# Altium project ECG_Project.PrjPCB
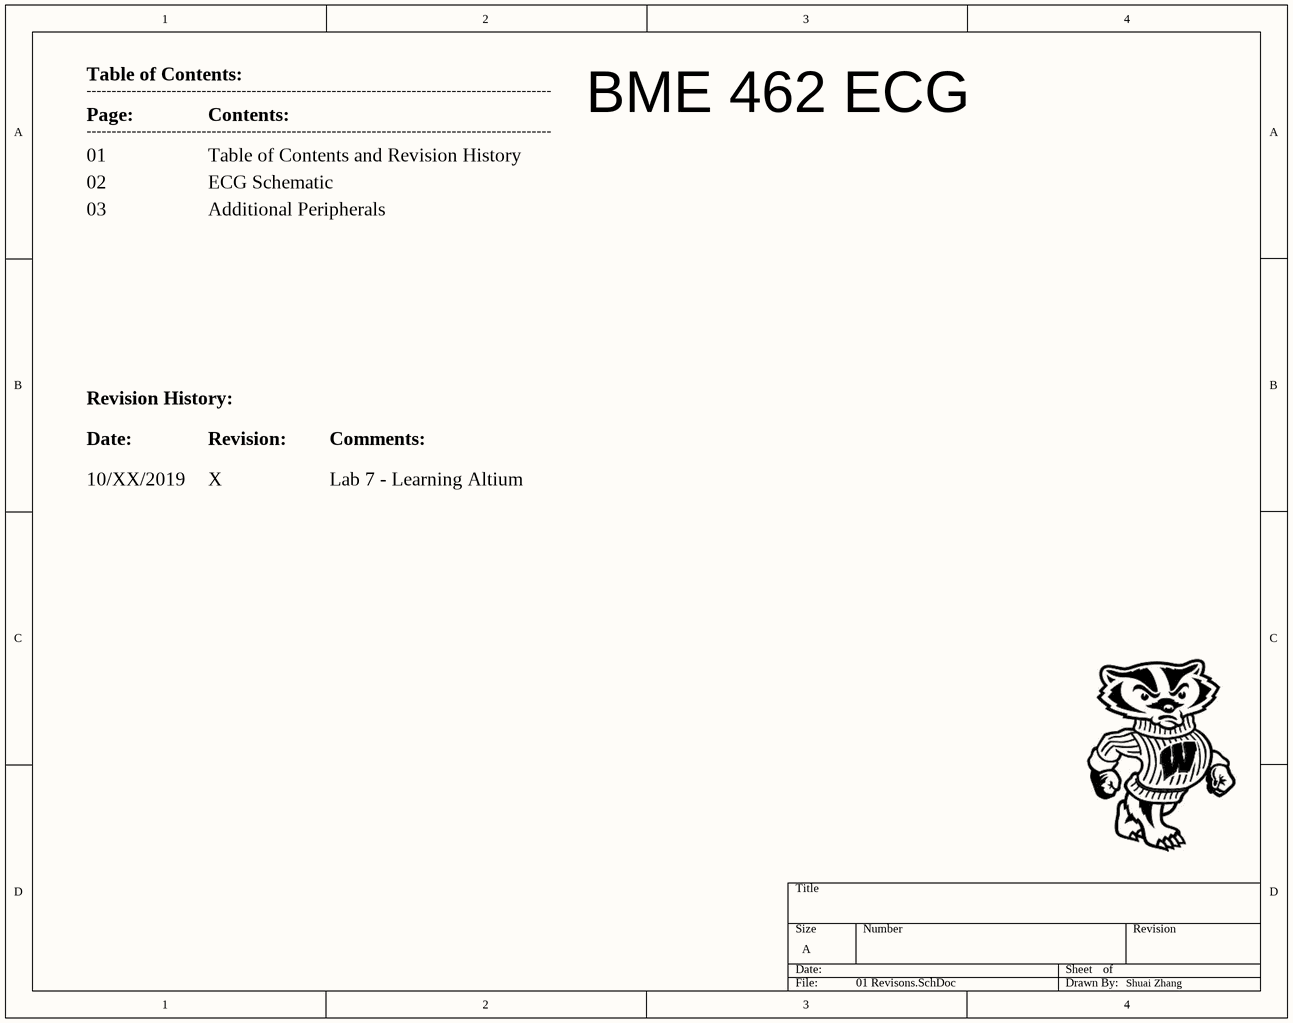
[diagram p0: 01 Revisons.SchDoc]
2 sheets, 26 parts. Net scope: global (net labels, ports and power ports of the same name join across sheets).
Board file: myPCB.PcbDoc
Sheets:
  01 Revisons.SchDoc
  02 ECG Amplifier.schdoc

## Sheet 01 Revisons.SchDoc
size A

### Notes on the sheet
- Table of Contents:
- ---------------------------------------------------------------------------------------------
- Page:
- 01
- Contents:
- Table of Contents and Revision History
- BME 462 ECG
- 02
- 03
- ECG Schematic
- Additional Peripherals
- Revision History:
- Date:
- 10/XX/2019
- Revision:
- X
- Comments:
- Lab 7 - Learning Altium
- Shuai Zhang

## Sheet 02 ECG Amplifier.schdoc
size A
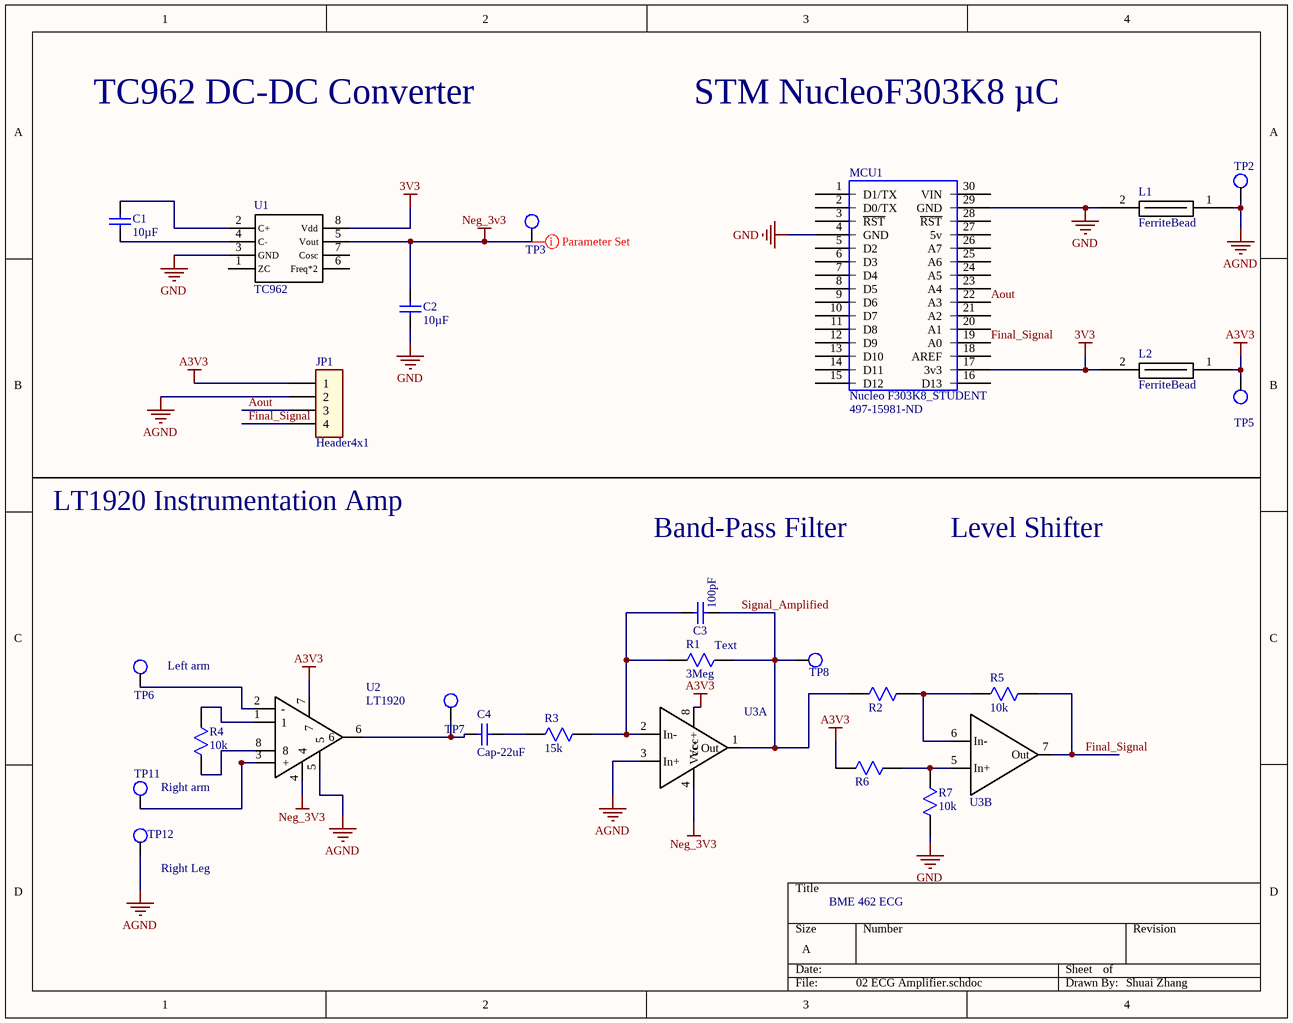
[diagram p1: 02 ECG Amplifier.schdoc]

### Parts
C1  Capacitance: 10µF  [Capacitor]  (hidden comment: Cap-10u)
C2  Capacitance: 10µF  [Capacitor]  (hidden comment: Cap-10u)
C3  Cap-100pF  [Capacitor]  (value not drawn)
C4  Cap-22uF  [Capacitor - Polarized]
JP1  Header4x1  [4 pin header]
L1  FerriteBead  [RESISTOR]
L2  FerriteBead  [RESISTOR]
MCU1  Nucleo F303K8_STUDENT  Supplier Part Number 1: 497-15981-ND  [Nucleo F303K8]
R1  Resistance (Ohms): 3Meg  [RESISTOR]  (hidden comment: Res-3M)
R2  20k  [RESISTOR]  (value not drawn)
R3  15k  [RESISTOR]
R4  Resistance (Ohms): 10k  [RESISTOR]  (hidden comment: Res-10k)
R5  Resistance (Ohms): 10k  [RESISTOR]  (hidden comment: Res-10k)
R6  20k  [RESISTOR]  (value not drawn)
R7  Resistance (Ohms): 10k  [RESISTOR]  (hidden comment: Res-10k)
TP2  TestPoint  [TestPoint]  (value not drawn)
TP3  TestPoint  [TestPoint]  (value not drawn)
TP5  TestPoint  [TestPoint]  (value not drawn)
TP6  TestPoint  [TestPoint]  (value not drawn)
TP7  TestPoint  [TestPoint]  (value not drawn)
TP8  TestPoint  [TestPoint]  (value not drawn)
TP11  TestPoint  [TestPoint]  (value not drawn)
TP12  TestPoint  [TestPoint]  (value not drawn)
U1  TC962  [DIP8]
U2  LT1920  [DIP8]
U3  TL072  [DIP8]  (value not drawn)  (parts A,B of 2)

### Nets
3V3: L2.2 MCU1.17(3v3) U1.8(Vdd)
A3V3: JP1.1 L2.1 R6.1 TP5.1 U2.7 U3.8(Vcc+)
AGND: JP1.2 L1.1 TP2.1 TP12.1 U2.5 U3.3(In+)
GND: C2.1 L1.2 MCU1.4(GND) MCU1.29(GND) R7.2 U1.3(GND)
Neg_3v3: C2.2 TP3.1 U1.5(Vout) U2.4 U3.4(Vcc-)
Aout: JP1.3 MCU1.22(A3)
Final_Signal: JP1.4 MCU1.19(A0) R5.2 U3.7(Out)
Signal_Amplified: C3.1 R1.2 R2.1 TP8.1 U3.1(Out)
NetC1_1: C1.1 U1.4(C-)
NetC1_2: C1.2 U1.2(C+)
NetC3_2: C3.2 R1.1 R3.2 U3.2(In-)
NetC4_1: C4.1 TP7.1 U2.6
NetC4_2: C4.2 R3.1
NetR2_2: R2.2 R5.1 U3.6(In-)
NetR4_1: R4.1 U2.1
NetR4_2: R4.2 U2.8
NetR6_2: R6.2 R7.1 U3.5(In+)
NetTP6_1: TP6.1 U2.2(-)
NetTP11_1: TP11.1 U2.3(+)

Not connected (* = marked no-connect by the designer): MCU1 1(D1/TX) 2(D0/TX) 3(~{RST}) 5(D2) 6(D3) 7(D4) 8(D5) 9(D6) 10(D7) 11(D8) 12(D9) 13(D10) 14(D11) 15(D12) 16(D13) 18(AREF) 20(A1) 21(A2) 23(A4) 24(A5) 25(A6) 26(A7) 27(5v) 28(~{RST}) 30(VIN); U1 1(ZC) 6(Freq*2) 7(Cosc)

### Notes on the sheet
- TC962 DC-DC Converter
- STM NucleoF303K8 µC
- LT1920 Instrumentation Amp
- Band-Pass Filter
- Level Shifter
- (near TP6) Left arm
- (near R1) Text
- Right arm
- (near TP12) Right Leg
- BME 462 ECG
- Shuai Zhang
- (in symbol Cap-100pF) 100pF

### Library data of the parts
C1 C2 = Cap-10u: Manufacturer: TDK Corporation; Manufacturer Part Number: FK26X7R1C106K; Tolerance: ±10%; Voltage - Rated: 16V; Temperature Coefficient: X7R; Supplier 1: Digi-Key; RoHS: RoHS Compliant; Category: Capacitors; Stock 1: 7933; Pricing 1: 1=0.45, 10=0.319, 100=0.2101, 250=0.17896, 500=0.1556, 1000=0.13226, 5000=0.1167, 10000=0.10892, 25000=0.10503 (USD); Packaging: Bulk; Mounting Type: Through Hole; Operating Temperature: -55°C ~ 125°C; Applications: General Purpose; Ratings: -; Package / Case: Radial; Size / Dimension: 0.217" L x 0.138" W (5.50mm x 3.50mm); Height - Seated (Max): 0.236" (6.00mm); Thickness (Max): -; Lead Spacing: 0.197" (5.00mm); Features: -; Lead Style: Formed Leads - Kinked; ComponentLink1URL: https://product.tdk.com/info/en/documents/catalog/leadmlcc_conventional_fk_en.pdf; ComponentLink1Description: https://product.tdk.com/info/en/documents/catalog/leadmlcc_conventional_fk_en.pdf; Supplier Part Number 1: 445-8549-ND
L1 L2 = FerriteBead: Manufacturer: Laird-Signal Integrity Products; Manufacturer Part Number: 28L0138-10R-10; Number of Lines: 1; Impedance @ Frequency: 75 Ohm @ 100MHz; Current Rating (Max): 5A; DC Resistance (DCR) (Max): 10 mOhm; Supplier 1: Digi-Key; RoHS: RoHS Compliant; Category: Filters; Stock 1: 25546; Pricing 1: 1=0.1, 10=0.076, 25=0.0684, 50=0.05, 100=0.0433, 250=0.03416, 500=0.02884, 1000=0.02429 (USD); Packaging: Cut Tape (CT); Part Status: Active; Filter Type: -; Ratings: -; Operating Temperature: -; Package / Case: Axial; Mounting Type: Through Hole; Height (Max): -; Size / Dimension: 0.138" Dia x 0.175" L (3.51mm x 4.45mm); ComponentLink1URL: http://media.digikey.com/pdf/Data%20Sheets/Laird%20Technologies/28L0138-10R-10_Dwg.pdf; ComponentLink1Description: http://media.digikey.com/pdf/Data%20Sheets/Laird%20Technologies/28L0138-10R-10_Dwg.pdf; Supplier Part Number 1: 240-2438-1-ND
MCU1 = Nucleo F303K8_STUDENT: Nucleo F303K8; Manufacturer: Sullins Connector Solutions; Manufacturer Part Number: PPTC151LFBN-RC; Connector Type: Header; Style: Board to Board; Number of Positions: 15; Number of Positions Loaded: All; Pitch - Mating: 0.100" (2.54mm); Contact Length - Post: 0.126" (3.20mm); Material Flammability Rating: UL94 V-0; Current Rating: 3A; Voltage Rating: 250V; Evaluation Kit: Yes; Number of Bits: 32; Core Architecture: ARM; RoHS: RoHS Compliant; Category: Connectors, Interconnects; Packaging: Bulk; Part Status: Active; Contact Type: Female Socket; Number of Rows: 1; Row Spacing - Mating: -; Mounting Type: Through Hole; Termination: Solder; Fastening Type: Push-Pull; Contact Finish - Mating: Tin; Contact Finish Thickness - Mating: -; Insulation Color: Black; Insulation Height: 0.335" (8.51mm); Operating Temperature: -40°C ~ 105°C; Contact Finish - Post: Tin; Mated Stacking Heights: -; Ingress Protection: -; Features: -; Applications: -; Insulation Material: Polyester; Contact Shape: Square; Contact Material: Phosphor Bronze; Contact Finish Thickness - Post: -; ComponentLink1URL: http://www.sullinscorp.com/drawings/78_P(N)PxCxxxLFBN-RC,_10492-H.pdf; ComponentLink1Description: http://www.sullinscorp.com/drawings/78_P(N)PxCxxxLFBN-RC,_10492-H.pdf; REACH SVHC: No SVHC; Lead Free: Lead Free; Supplier 1: Digi-Key; Stock 1: 117; Pricing 1: 1=10.99000 (USD); ComponentLink2URL: http://www.farnell.com/datasheets/2064195.pdf?src-supplier=Farnell; ComponentLink2Description: http://www.farnell.com/datasheets/2064195.pdf?src-supplier=Farnell; ComponentLink3URL: http://www.st.com/content/ccc/resource/technical/document/data_brief/b1/d8/13/d4/b0/b7/4b/6e/DM00214578.pdf/files/DM00214578.pdf/jcr:content/translations/en.DM00214578.pdf?src-supplier=Digi-Key; ComponentLink3Description: http://www.st.com/content/ccc/resource/technical/document/data_brief/b1/d8/13/d4/b0/b7/4b/6e/DM00214578.pdf/files/DM00214578.pdf/jcr:content/translations/en.DM00214578.pdf?src-supplier=Digi-Key; ComponentLink4URL: http://www.farnell.com/datasheets/1966773.pdf?src-supplier=Element14; ComponentLink4Description: http://www.farnell.com/datasheets/1966773.pdf?src-supplier=Element14; ComponentLink5URL: http://www.farnell.com/datasheets/2064195.pdf?src-supplier=Newark; ComponentLink5Description: http://www.farnell.com/datasheets/2064195.pdf?src-supplier=Newark; ComponentLink6URL: http://www.st.com/st-web-ui/static/active/en/resource/technical/document/user_manual/DM00116575.pdf?s_searchtype=keyword&src-supplier=Avnet+Asia; ComponentLink6Description: http://www.st.com/st-web-ui/static/active/en/resource/technical/document/user_manual/DM00116575.pdf?s_searchtype=keyword&src-supplier=Avnet+Asia; ComponentLink7URL: http://www.st.com/st-web-ui/static/active/en/resource/technical/document/user_manual/DM00116575.pdf?s_searchtype=keyword&src-supplier=Avnet; ComponentLink7Description: http://www.st.com/st-web-ui/static/active/en/resource/technical/document/user_manual/DM00116575.pdf?s_searchtype=keyword&src-supplier=Avnet
R1 = Res-3M: Manufacturer: Stackpole Electronics Inc.; Manufacturer Part Number: CF14JT30K0; Tolerance: ±5%; Power (Watts): 0.25W, 1/4W; Temperature Coefficient: 0/ -500ppm/°C; RoHS: RoHS Compliant; Category: Resistors; Packaging: Cut Tape (CT); Part Status: Active; Composition: Carbon Film; Features: Flame Retardant Coating, Safety; Operating Temperature: -55°C ~ 155°C; Package / Case: Axial; Supplier Device Package: Axial; Size / Dimension: 0.091" Dia x 0.236" L (2.30mm x 6.00mm); Height - Seated (Max): -; Failure Rate: -; ComponentLink1URL: https://www.seielect.com/Catalog/SEI-CF_CFM.pdf; ComponentLink1Description: https://www.seielect.com/Catalog/SEI-CF_CFM.pdf; Supplier 1: Arrow
R2 R6 = Res-20k: Supplier 1: Arrow
R3 = Res-15k: Supplier 1: Arrow
R4 R5 R7 = Res-10k: Manufacturer: Stackpole Electronics Inc.; Manufacturer Part Number: CF14JT10K0; Tolerance: ±5%; Power (Watts): 0.25W, 1/4W; Temperature Coefficient: 0/ -500ppm/°C; Supplier 1: Digi-Key; RoHS: RoHS Compliant; Category: Resistors; Stock 1: 1509635; Pricing 1: 1=0.1, 10=0.04, 50=0.022, 100=0.0162, 250=0.01236, 500=0.0099, 1000=0.00729, 2500=0.00632 (USD); Packaging: Cut Tape (CT); Composition: Carbon Film; Features: Flame Retardant Coating, Safety; Operating Temperature: -55°C ~ 155°C; Package / Case: Axial; Supplier Device Package: Axial; Size / Dimension: 0.091" Dia x 0.256" L (2.30mm x 6.50mm); Height: -; Number of Terminations: 2; ComponentLink1URL: http://www.seielect.com/catalog/SEI-CF_CFM.pdf; ComponentLink1Description: http://www.seielect.com/catalog/SEI-CF_CFM.pdf; Supplier Part Number 1: CF14JT10K0CT-ND
TP2 TP3 TP5-TP8 TP11 TP12 = TestPoint: Usage: DNP
U3 = TL072: Manufacturer: Texas Instruments; Manufacturer Part Number: TL072IP; Amplifier Type: J-FET; Number of Circuits: 2; Slew Rate: 13 V/µs; Current - Supply: 1.4mA; Voltage - Supply, Single/Dual (±): 7 V ~ 36 V, ±3.5 V ~ 18 V; Supplier 1: Digi-Key; RoHS: RoHS Compliant; Category: Integrated Circuits (ICs); Stock 1: 2537; Pricing 1: 1=0.69, 10=0.607, 100=0.4655, 500=0.368, 1000=0.2944 (USD); Packaging: Tube; Part Status: Active; Output Type: -; -3db Bandwidth: -; Current - Output / Channel: -; Operating Temperature: -40°C ~ 85°C; Mounting Type: Through Hole; Package / Case: 8-DIP (0.300", 7.62mm); Supplier Device Package: 8-PDIP; ComponentLink1URL: http://www.ti.com/lit/ds/symlink/tl071a.pdf; ComponentLink1Description: http://www.ti.com/lit/ds/symlink/tl071a.pdf; Supplier Part Number 1: 296-14997-5-ND
C3 = Cap-100pF: Supplier 1: Digi-Key
U1 = TC962: Supplier 1: Digi-Key; Supplier Part Number 1: TC962CPA-ND
U2 = LT1920: Supplier 1: Digi-Key; Supplier Part Number 1: LT1920CN8#PBF-ND